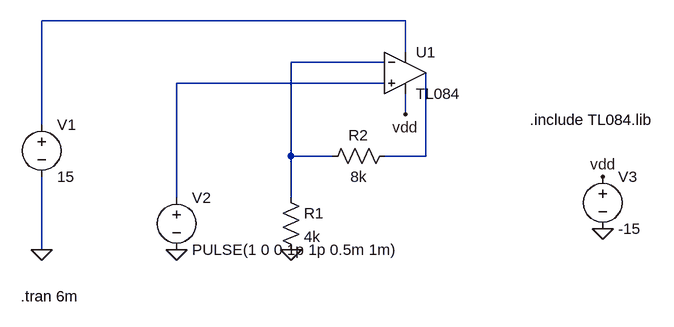
[diagram p0: schematic NonInverting.asc]
NonInverting.asc, the LTspice schematic file:
Version 4
SHEET 1 896 680
WIRE 496 -48 -64 -48
WIRE 496 0 496 -48
WIRE 464 16 320 16
WIRE 464 48 144 48
WIRE 496 96 496 64
WIRE -64 112 -64 -48
WIRE 320 160 320 16
WIRE 384 160 320 160
WIRE 528 160 528 32
WIRE 528 160 464 160
WIRE 144 224 144 48
WIRE 320 224 320 160
WIRE -64 304 -64 192
FLAG 320 304 0
FLAG 144 304 0
FLAG -64 304 0
FLAG 800 272 0
FLAG 800 192 vdd
FLAG 496 96 vdd
SYMBOL voltage -64 96 R0
WINDOW 123 0 0 Left 0
WINDOW 39 0 0 Left 0
SYMATTR InstName V1
SYMATTR Value 15
SYMBOL res 304 208 R0
SYMATTR InstName R1
SYMATTR Value 4k
SYMBOL res 480 144 R90
WINDOW 0 0 56 VBottom 2
WINDOW 3 32 56 VTop 2
SYMATTR InstName R2
SYMATTR Value 8k
SYMBOL voltage 144 208 R0
WINDOW 123 0 0 Left 0
WINDOW 39 0 0 Left 0
SYMATTR InstName V2
SYMATTR Value PULSE(1 0 0 1p 1p 0.5m 1m)
SYMBOL OpAmps\\opamp2 496 -32 R0
SYMATTR InstName U1
SYMATTR Value TL084
SYMBOL voltage 800 176 R0
WINDOW 123 0 0 Left 0
WINDOW 39 0 0 Left 0
SYMATTR InstName V3
SYMATTR Value -15
TEXT 688 104 Left 2 !.include TL084.lib
TEXT -96 376 Left 2 !.tran 6m

The netlist it stands for:
* NonInverting.asc
V1 N001 0 15
R1 N002 0 4k
R2 N004 N002 8k
V2 N003 0 PULSE(1 0 0 1p 1p 0.5m 1m)
XU1 N003 N002 N001 vdd N004 TL084  ; pins In+ In- V+ V- OUT
V3 vdd 0 -15
.include TL084.lib
.tran 6m
.backanno
.end